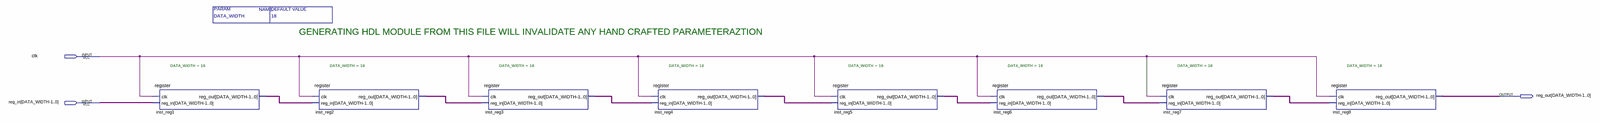
[diagram p0: schematic sheet, whole]
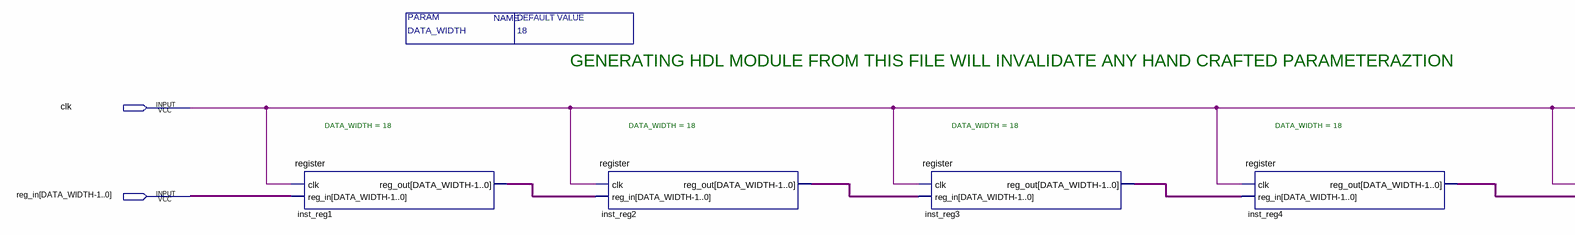
[diagram p1: schematic sheet, left part]
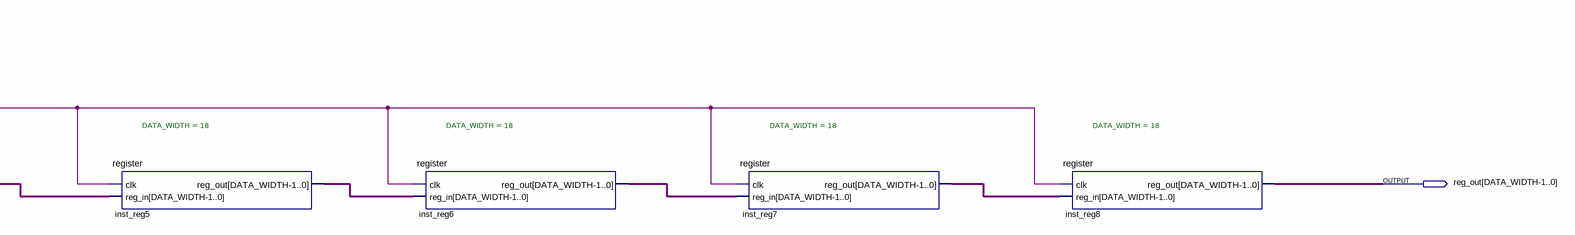
[diagram p2: schematic sheet, right part]
// Quartus schematic reg_delay_8L.bdf as structural Verilog: 8 symbols, 3 pins
module reg_delay_8L #(parameter DATA_WIDTH = 18) (
  input  clk,
  input  [17:0] reg_in,
  output [17:0] reg_out
);

  wire [17:0] inst_reg1_reg_out, inst_reg2_reg_out, inst_reg3_reg_out, inst_reg4_reg_out, inst_reg5_reg_out,
       inst_reg6_reg_out, inst_reg7_reg_out;

  register #(.DATA_WIDTH(18)) inst_reg1 (.clk(clk), .reg_in(reg_in), .reg_out(inst_reg1_reg_out));
  register #(.DATA_WIDTH(18)) inst_reg2 (.clk(clk), .reg_in(inst_reg1_reg_out), .reg_out(inst_reg2_reg_out));
  register #(.DATA_WIDTH(18)) inst_reg3 (.clk(clk), .reg_in(inst_reg2_reg_out), .reg_out(inst_reg3_reg_out));
  register #(.DATA_WIDTH(18)) inst_reg4 (.clk(clk), .reg_in(inst_reg3_reg_out), .reg_out(inst_reg4_reg_out));
  register #(.DATA_WIDTH(18)) inst_reg5 (.clk(clk), .reg_in(inst_reg4_reg_out), .reg_out(inst_reg5_reg_out));
  register #(.DATA_WIDTH(18)) inst_reg6 (.clk(clk), .reg_in(inst_reg5_reg_out), .reg_out(inst_reg6_reg_out));
  register #(.DATA_WIDTH(18)) inst_reg7 (.clk(clk), .reg_in(inst_reg6_reg_out), .reg_out(inst_reg7_reg_out));
  register #(.DATA_WIDTH(18)) inst_reg8 (.clk(clk), .reg_in(inst_reg7_reg_out), .reg_out(reg_out));

  // Notes on the sheet:
  //   GENERATING HDL MODULE FROM THIS FILE WILL INVALIDATE ANY HAND CRAFTED PARAMETERAZTION
endmodule
